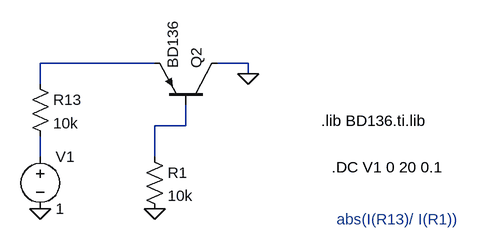
[diagram p0: schematic ECDLab2BetaFatih.asc]
ECDLab2BetaFatih.asc, the LTspice schematic file:
Version 4
SHEET 1 1400 680
WIRE -800 48 -976 48
WIRE -656 48 -704 48
WIRE -656 64 -656 48
WIRE -976 80 -976 48
WIRE -752 144 -752 112
WIRE -752 144 -800 144
WIRE -976 192 -976 160
WIRE -800 192 -800 144
FLAG -800 272 0
FLAG -976 272 0
FLAG -656 64 0
SYMBOL pnp -704 112 M270
SYMATTR InstName Q2
SYMATTR Value BD136
SYMBOL res -992 64 R0
SYMATTR InstName R13
SYMATTR Value 10k
SYMBOL voltage -976 176 R0
WINDOW 123 0 0 Left 0
WINDOW 39 0 0 Left 0
SYMATTR InstName V1
SYMATTR Value 1
SYMBOL res -816 176 R0
SYMATTR InstName R1
SYMATTR Value 10k
TEXT -544 136 Left 2 !.lib BD136.ti.lib
TEXT -528 208 Left 2 !.DC V1 0 20 0.1
TEXT -520 288 Left 2 ;abs(I(R13)/ I(R1))

The netlist it stands for:
* ECDLab2BetaFatih.asc
Q2 0 N002 N001 0 BD136
R13 N001 N003 10k
V1 N003 0 1
R1 N002 0 10k
.model NPN NPN
.model PNP PNP
.lib standard.bjt
.lib BD136.ti.lib
.DC V1 0 20 0.1
* abs(I(R13)/ I(R1))
.backanno
.end